# Altium schematic sheet MainBoard_Top.SchDoc
size C
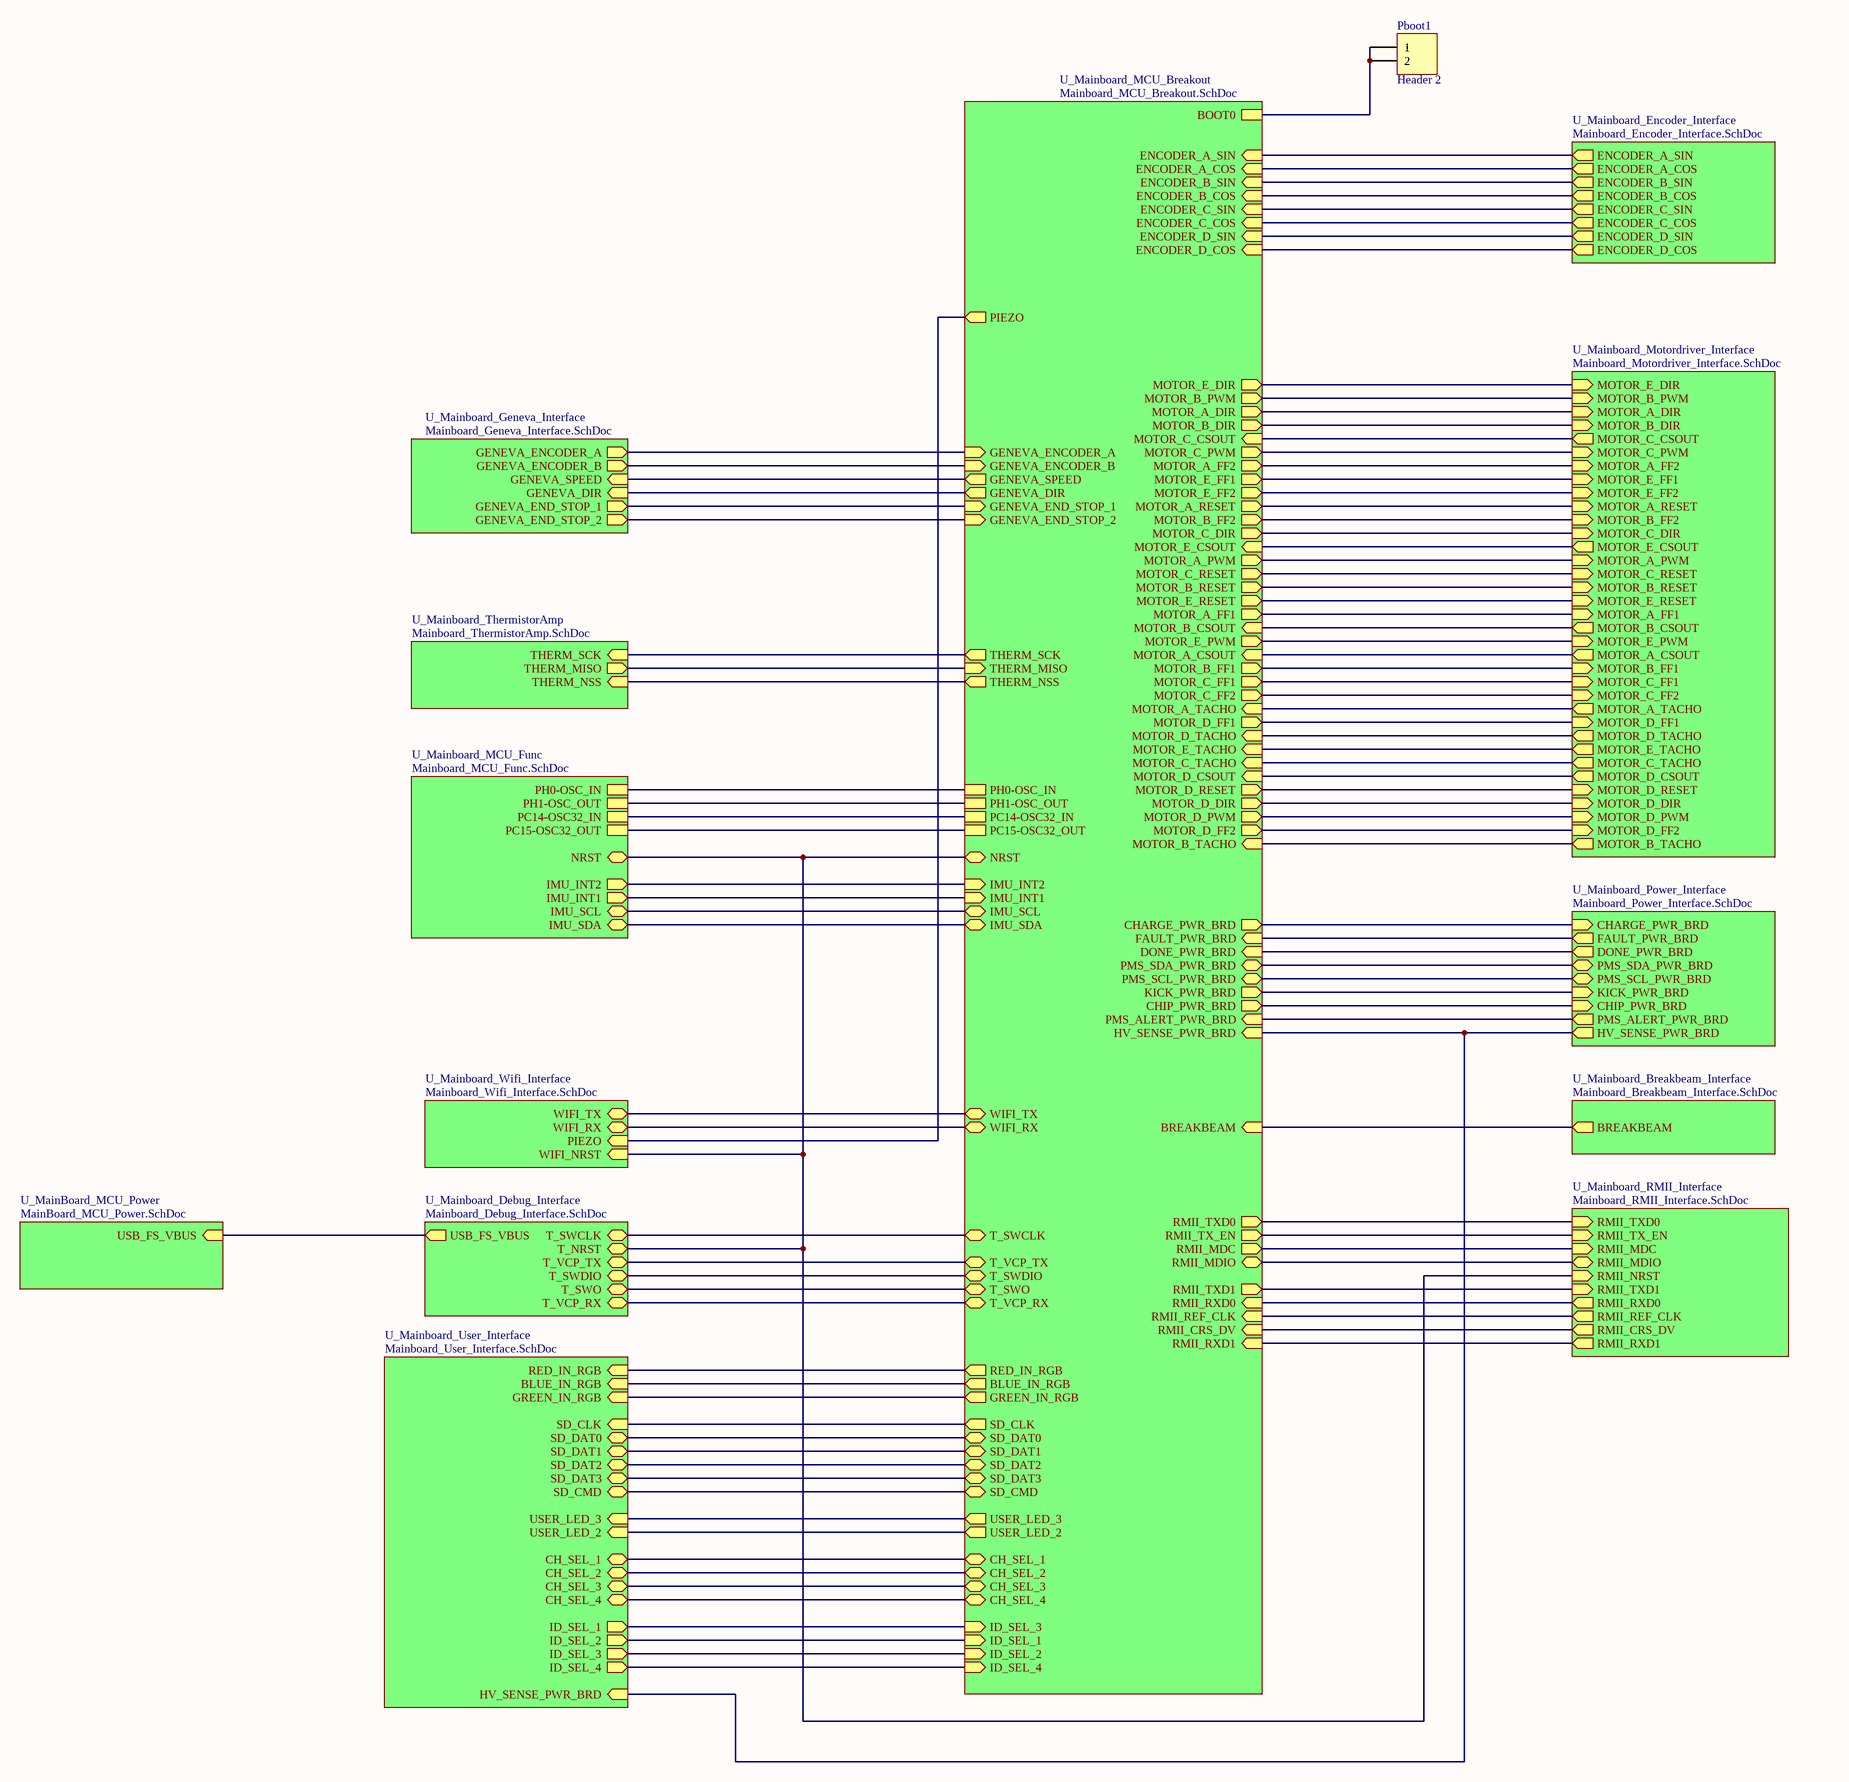
[diagram p0: MainBoard_Top.SchDoc]

## Parts
Pboot1  Header 2  [HDR1X2]

## Sub-sheets
U_Mainboard_Breakbeam_Interface = Mainboard_Breakbeam_Interface.SchDoc: BREAKBEAM (out)
U_Mainboard_Debug_Interface = Mainboard_Debug_Interface.SchDoc: USB_FS_VBUS (out), T_SWCLK (bidir), T_NRST (bidir), T_VCP_TX (bidir), T_SWDIO (bidir), T_SWO (bidir), T_VCP_RX (bidir)
U_Mainboard_Encoder_Interface = Mainboard_Encoder_Interface.SchDoc: ENCODER_A_SIN (out), ENCODER_B_COS (out), ENCODER_C_COS (out), ENCODER_A_COS (out), ENCODER_D_SIN (out), ENCODER_D_COS (out), ENCODER_B_SIN (out), ENCODER_C_SIN (out)
U_Mainboard_Geneva_Interface = Mainboard_Geneva_Interface.SchDoc: GENEVA_SPEED (in), GENEVA_ENCODER_A (out), GENEVA_ENCODER_B (out), GENEVA_DIR (in), GENEVA_END_STOP_1 (out), GENEVA_END_STOP_2 (out)
U_Mainboard_MCU_Breakout = Mainboard_MCU_Breakout.SchDoc: BOOT0, T_SWCLK (bidir), T_VCP_TX (bidir), T_SWDIO (bidir), T_SWO (bidir), T_VCP_RX (bidir), RED_IN_RGB (out), BLUE_IN_RGB (out), GREEN_IN_RGB (out), SD_CLK (out), SD_DAT0 (bidir), SD_DAT1 (bidir), SD_DAT2 (bidir), SD_DAT3 (bidir), SD_CMD (bidir), CH_SEL_1 (bidir), CH_SEL_2 (bidir), CH_SEL_3 (bidir), CH_SEL_4 (bidir), ENCODER_A_SIN (in), ENCODER_A_COS (in), ENCODER_B_SIN (in), ENCODER_B_COS (in), ENCODER_C_SIN (in), ENCODER_C_COS (in), ENCODER_D_SIN (in), ENCODER_D_COS (in), USER_LED_3 (out), USER_LED_2 (out), PC15-OSC32_OUT, PC14-OSC32_IN, PH1-OSC_OUT, NRST (bidir), PH0-OSC_IN, IMU_INT2 (in), IMU_INT1 (in), BREAKBEAM (in), RMII_TXD0 (out), RMII_TX_EN (out), RMII_MDC (out), RMII_MDIO (bidir), RMII_TXD1 (out), RMII_RXD0 (in), RMII_REF_CLK (in), RMII_CRS_DV (in), RMII_RXD1 (in), HV_SENSE_PWR_BRD (in), PMS_ALERT_PWR_BRD (in), CHIP_PWR_BRD (out), KICK_PWR_BRD (out), PMS_SCL_PWR_BRD (bidir), PMS_SDA_PWR_BRD (bidir), DONE_PWR_BRD (in), FAULT_PWR_BRD (in), CHARGE_PWR_BRD (out), IMU_SDA (bidir), IMU_SCL (bidir), THERM_NSS (out), THERM_MISO (in), THERM_SCK (out), WIFI_RX (bidir), WIFI_TX (bidir), ID_SEL_3 (in), ID_SEL_1 (in), ID_SEL_2 (in), ID_SEL_4 (in), MOTOR_E_DIR (out), MOTOR_B_PWM (out), MOTOR_A_DIR (out), MOTOR_B_DIR (out), MOTOR_C_CSOUT (in), MOTOR_C_PWM (out), MOTOR_A_FF2 (out), MOTOR_E_FF1 (out), MOTOR_E_FF2 (out), MOTOR_A_RESET (out), MOTOR_B_FF2 (out), MOTOR_C_DIR (out), MOTOR_E_CSOUT (in), MOTOR_A_PWM (out), MOTOR_C_RESET (out), MOTOR_B_RESET (out), MOTOR_E_RESET (out), MOTOR_A_FF1 (out), MOTOR_B_CSOUT (in), MOTOR_E_PWM (out), MOTOR_A_CSOUT (in), MOTOR_B_FF1 (out), MOTOR_C_FF1 (out), MOTOR_C_FF2 (out), MOTOR_A_TACHO (in), MOTOR_D_FF1 (out), MOTOR_D_TACHO (in), MOTOR_E_TACHO (in), MOTOR_C_TACHO (in), MOTOR_D_CSOUT (in), MOTOR_D_RESET (out), MOTOR_D_DIR (out), MOTOR_D_PWM (out), MOTOR_D_FF2 (out), MOTOR_B_TACHO (in), GENEVA_ENCODER_B (in), GENEVA_ENCODER_A (in), GENEVA_SPEED (out), PIEZO (out), GENEVA_DIR (out), GENEVA_END_STOP_2 (in), GENEVA_END_STOP_1 (in)
U_Mainboard_MCU_Func = Mainboard_MCU_Func.SchDoc: NRST (bidir), IMU_SCL (bidir), IMU_SDA (bidir), IMU_INT1 (out), IMU_INT2 (out), PH0-OSC_IN, PH1-OSC_OUT, PC14-OSC32_IN, PC15-OSC32_OUT
U_MainBoard_MCU_Power = MainBoard_MCU_Power.SchDoc: USB_FS_VBUS (in)
U_Mainboard_Motordriver_Interface = Mainboard_Motordriver_Interface.SchDoc: MOTOR_E_DIR (in), MOTOR_B_PWM (in), MOTOR_A_DIR (in), MOTOR_B_DIR (in), MOTOR_C_CSOUT (out), MOTOR_C_PWM (in), MOTOR_A_FF2 (in), MOTOR_E_FF1 (in), MOTOR_E_FF2 (in), MOTOR_A_RESET (in), MOTOR_B_FF2 (in), MOTOR_C_DIR (in), MOTOR_E_CSOUT (out), MOTOR_A_PWM (in), MOTOR_C_RESET (in), MOTOR_B_RESET (in), MOTOR_E_RESET (in), MOTOR_A_FF1 (in), MOTOR_B_CSOUT (out), MOTOR_E_PWM (in), MOTOR_A_CSOUT (out), MOTOR_B_FF1 (in), MOTOR_C_FF1 (in), MOTOR_C_FF2 (in), MOTOR_A_TACHO (out), MOTOR_D_FF1 (in), MOTOR_D_TACHO (out), MOTOR_E_TACHO (out), MOTOR_C_TACHO (out), MOTOR_D_CSOUT (out), MOTOR_D_RESET (in), MOTOR_D_DIR (in), MOTOR_D_PWM (in), MOTOR_D_FF2 (in), MOTOR_B_TACHO (out)
U_Mainboard_Power_Interface = Mainboard_Power_Interface.SchDoc: CHARGE_PWR_BRD (in), FAULT_PWR_BRD (out), DONE_PWR_BRD (out), PMS_SDA_PWR_BRD (bidir), PMS_SCL_PWR_BRD (bidir), KICK_PWR_BRD (in), CHIP_PWR_BRD (in), PMS_ALERT_PWR_BRD (out), HV_SENSE_PWR_BRD (out)
U_Mainboard_RMII_Interface = Mainboard_RMII_Interface.SchDoc: RMII_TXD0 (in), RMII_TX_EN (in), RMII_RXD0 (out), RMII_REF_CLK (out), RMII_CRS_DV (out), RMII_MDC (in), RMII_MDIO (bidir), RMII_NRST (in), RMII_TXD1 (in), RMII_RXD1 (out)
U_Mainboard_ThermistorAmp = Mainboard_ThermistorAmp.SchDoc: THERM_NSS (in), THERM_MISO (out), THERM_SCK (in)
U_Mainboard_User_Interface = Mainboard_User_Interface.SchDoc: RED_IN_RGB (in), BLUE_IN_RGB (in), GREEN_IN_RGB (in), SD_CLK (in), SD_DAT0 (bidir), SD_DAT1 (bidir), SD_DAT2 (bidir), SD_DAT3 (bidir), SD_CMD (bidir), USER_LED_3 (in), USER_LED_2 (in), CH_SEL_1 (bidir), CH_SEL_2 (bidir), CH_SEL_3 (bidir), CH_SEL_4 (bidir), ID_SEL_1 (out), ID_SEL_2 (out), ID_SEL_3 (out), ID_SEL_4 (out), HV_SENSE_PWR_BRD (in)
U_Mainboard_Wifi_Interface = Mainboard_Wifi_Interface.SchDoc: WIFI_NRST (in), WIFI_TX (bidir), WIFI_RX (bidir), PIEZO (in)

## Nets
NetPboot1_1: Pboot1.1 Pboot1.2 ; sheet U_Mainboard_MCU_Breakout/BOOT0
(unnamed): sheet U_Mainboard_Encoder_Interface/ENCODER_A_SIN, sheet U_Mainboard_MCU_Breakout/ENCODER_A_SIN
(unnamed): sheet U_Mainboard_Encoder_Interface/ENCODER_B_COS, sheet U_Mainboard_MCU_Breakout/ENCODER_B_COS
(unnamed): sheet U_Mainboard_Encoder_Interface/ENCODER_C_COS, sheet U_Mainboard_MCU_Breakout/ENCODER_C_COS
(unnamed): sheet U_Mainboard_Encoder_Interface/ENCODER_A_COS, sheet U_Mainboard_MCU_Breakout/ENCODER_A_COS
(unnamed): sheet U_Mainboard_Encoder_Interface/ENCODER_D_SIN, sheet U_Mainboard_MCU_Breakout/ENCODER_D_SIN
(unnamed): sheet U_Mainboard_Encoder_Interface/ENCODER_D_COS, sheet U_Mainboard_MCU_Breakout/ENCODER_D_COS
(unnamed): sheet U_Mainboard_Encoder_Interface/ENCODER_B_SIN, sheet U_Mainboard_MCU_Breakout/ENCODER_B_SIN
(unnamed): sheet U_Mainboard_Encoder_Interface/ENCODER_C_SIN, sheet U_Mainboard_MCU_Breakout/ENCODER_C_SIN
(unnamed): sheet U_Mainboard_Motordriver_Interface/MOTOR_E_DIR, sheet U_Mainboard_MCU_Breakout/MOTOR_E_DIR
(unnamed): sheet U_Mainboard_Motordriver_Interface/MOTOR_B_PWM, sheet U_Mainboard_MCU_Breakout/MOTOR_B_PWM
(unnamed): sheet U_Mainboard_Motordriver_Interface/MOTOR_A_DIR, sheet U_Mainboard_MCU_Breakout/MOTOR_A_DIR
(unnamed): sheet U_Mainboard_Motordriver_Interface/MOTOR_B_DIR, sheet U_Mainboard_MCU_Breakout/MOTOR_B_DIR
(unnamed): sheet U_Mainboard_Motordriver_Interface/MOTOR_C_CSOUT, sheet U_Mainboard_MCU_Breakout/MOTOR_C_CSOUT
(unnamed): sheet U_Mainboard_Motordriver_Interface/MOTOR_C_PWM, sheet U_Mainboard_MCU_Breakout/MOTOR_C_PWM
(unnamed): sheet U_Mainboard_Motordriver_Interface/MOTOR_A_FF2, sheet U_Mainboard_MCU_Breakout/MOTOR_A_FF2
(unnamed): sheet U_Mainboard_Motordriver_Interface/MOTOR_E_FF1, sheet U_Mainboard_MCU_Breakout/MOTOR_E_FF1
(unnamed): sheet U_Mainboard_Motordriver_Interface/MOTOR_E_FF2, sheet U_Mainboard_MCU_Breakout/MOTOR_E_FF2
(unnamed): sheet U_Mainboard_Motordriver_Interface/MOTOR_A_RESET, sheet U_Mainboard_MCU_Breakout/MOTOR_A_RESET
(unnamed): sheet U_Mainboard_Motordriver_Interface/MOTOR_B_FF2, sheet U_Mainboard_MCU_Breakout/MOTOR_B_FF2
(unnamed): sheet U_Mainboard_Motordriver_Interface/MOTOR_C_DIR, sheet U_Mainboard_MCU_Breakout/MOTOR_C_DIR
(unnamed): sheet U_Mainboard_Motordriver_Interface/MOTOR_E_CSOUT, sheet U_Mainboard_MCU_Breakout/MOTOR_E_CSOUT
(unnamed): sheet U_Mainboard_Motordriver_Interface/MOTOR_A_PWM, sheet U_Mainboard_MCU_Breakout/MOTOR_A_PWM
(unnamed): sheet U_Mainboard_Motordriver_Interface/MOTOR_C_RESET, sheet U_Mainboard_MCU_Breakout/MOTOR_C_RESET
(unnamed): sheet U_Mainboard_Motordriver_Interface/MOTOR_B_RESET, sheet U_Mainboard_MCU_Breakout/MOTOR_B_RESET
(unnamed): sheet U_Mainboard_Motordriver_Interface/MOTOR_E_RESET, sheet U_Mainboard_MCU_Breakout/MOTOR_E_RESET
(unnamed): sheet U_Mainboard_Motordriver_Interface/MOTOR_A_FF1, sheet U_Mainboard_MCU_Breakout/MOTOR_A_FF1
(unnamed): sheet U_Mainboard_Motordriver_Interface/MOTOR_B_CSOUT, sheet U_Mainboard_MCU_Breakout/MOTOR_B_CSOUT
(unnamed): sheet U_Mainboard_Motordriver_Interface/MOTOR_E_PWM, sheet U_Mainboard_MCU_Breakout/MOTOR_E_PWM
(unnamed): sheet U_Mainboard_Motordriver_Interface/MOTOR_A_CSOUT, sheet U_Mainboard_MCU_Breakout/MOTOR_A_CSOUT
(unnamed): sheet U_Mainboard_Motordriver_Interface/MOTOR_B_FF1, sheet U_Mainboard_MCU_Breakout/MOTOR_B_FF1
(unnamed): sheet U_Mainboard_Motordriver_Interface/MOTOR_C_FF1, sheet U_Mainboard_MCU_Breakout/MOTOR_C_FF1
(unnamed): sheet U_Mainboard_Motordriver_Interface/MOTOR_C_FF2, sheet U_Mainboard_MCU_Breakout/MOTOR_C_FF2
(unnamed): sheet U_Mainboard_Motordriver_Interface/MOTOR_A_TACHO, sheet U_Mainboard_MCU_Breakout/MOTOR_A_TACHO
(unnamed): sheet U_Mainboard_Motordriver_Interface/MOTOR_D_FF1, sheet U_Mainboard_MCU_Breakout/MOTOR_D_FF1
(unnamed): sheet U_Mainboard_Motordriver_Interface/MOTOR_D_TACHO, sheet U_Mainboard_MCU_Breakout/MOTOR_D_TACHO
(unnamed): sheet U_Mainboard_Motordriver_Interface/MOTOR_E_TACHO, sheet U_Mainboard_MCU_Breakout/MOTOR_E_TACHO
(unnamed): sheet U_Mainboard_Motordriver_Interface/MOTOR_C_TACHO, sheet U_Mainboard_MCU_Breakout/MOTOR_C_TACHO
(unnamed): sheet U_Mainboard_Motordriver_Interface/MOTOR_D_CSOUT, sheet U_Mainboard_MCU_Breakout/MOTOR_D_CSOUT
(unnamed): sheet U_Mainboard_Motordriver_Interface/MOTOR_D_RESET, sheet U_Mainboard_MCU_Breakout/MOTOR_D_RESET
(unnamed): sheet U_Mainboard_Motordriver_Interface/MOTOR_D_DIR, sheet U_Mainboard_MCU_Breakout/MOTOR_D_DIR
(unnamed): sheet U_Mainboard_Motordriver_Interface/MOTOR_D_PWM, sheet U_Mainboard_MCU_Breakout/MOTOR_D_PWM
(unnamed): sheet U_Mainboard_Motordriver_Interface/MOTOR_D_FF2, sheet U_Mainboard_MCU_Breakout/MOTOR_D_FF2
(unnamed): sheet U_Mainboard_Motordriver_Interface/MOTOR_B_TACHO, sheet U_Mainboard_MCU_Breakout/MOTOR_B_TACHO
(unnamed): sheet U_Mainboard_Power_Interface/CHARGE_PWR_BRD, sheet U_Mainboard_MCU_Breakout/CHARGE_PWR_BRD
(unnamed): sheet U_Mainboard_Power_Interface/FAULT_PWR_BRD, sheet U_Mainboard_MCU_Breakout/FAULT_PWR_BRD
(unnamed): sheet U_Mainboard_Power_Interface/DONE_PWR_BRD, sheet U_Mainboard_MCU_Breakout/DONE_PWR_BRD
(unnamed): sheet U_Mainboard_Power_Interface/PMS_SDA_PWR_BRD, sheet U_Mainboard_MCU_Breakout/PMS_SDA_PWR_BRD
(unnamed): sheet U_Mainboard_Power_Interface/PMS_SCL_PWR_BRD, sheet U_Mainboard_MCU_Breakout/PMS_SCL_PWR_BRD
(unnamed): sheet U_Mainboard_Power_Interface/KICK_PWR_BRD, sheet U_Mainboard_MCU_Breakout/KICK_PWR_BRD
(unnamed): sheet U_Mainboard_Power_Interface/CHIP_PWR_BRD, sheet U_Mainboard_MCU_Breakout/CHIP_PWR_BRD
(unnamed): sheet U_Mainboard_Power_Interface/PMS_ALERT_PWR_BRD, sheet U_Mainboard_MCU_Breakout/PMS_ALERT_PWR_BRD
(unnamed): sheet U_Mainboard_Power_Interface/HV_SENSE_PWR_BRD, sheet U_Mainboard_MCU_Breakout/HV_SENSE_PWR_BRD, sheet U_Mainboard_User_Interface/HV_SENSE_PWR_BRD
(unnamed): sheet U_Mainboard_RMII_Interface/RMII_TXD0, sheet U_Mainboard_MCU_Breakout/RMII_TXD0
(unnamed): sheet U_Mainboard_RMII_Interface/RMII_TX_EN, sheet U_Mainboard_MCU_Breakout/RMII_TX_EN
(unnamed): sheet U_Mainboard_RMII_Interface/RMII_RXD0, sheet U_Mainboard_MCU_Breakout/RMII_RXD0
(unnamed): sheet U_Mainboard_RMII_Interface/RMII_REF_CLK, sheet U_Mainboard_MCU_Breakout/RMII_REF_CLK
(unnamed): sheet U_Mainboard_RMII_Interface/RMII_CRS_DV, sheet U_Mainboard_MCU_Breakout/RMII_CRS_DV
(unnamed): sheet U_Mainboard_RMII_Interface/RMII_MDC, sheet U_Mainboard_MCU_Breakout/RMII_MDC
(unnamed): sheet U_Mainboard_RMII_Interface/RMII_MDIO, sheet U_Mainboard_MCU_Breakout/RMII_MDIO
(unnamed): sheet U_Mainboard_RMII_Interface/RMII_NRST, sheet U_Mainboard_Wifi_Interface/WIFI_NRST, sheet U_Mainboard_Debug_Interface/T_NRST, sheet U_Mainboard_MCU_Breakout/NRST, sheet U_Mainboard_MCU_Func/NRST
(unnamed): sheet U_Mainboard_RMII_Interface/RMII_TXD1, sheet U_Mainboard_MCU_Breakout/RMII_TXD1
(unnamed): sheet U_Mainboard_RMII_Interface/RMII_RXD1, sheet U_Mainboard_MCU_Breakout/RMII_RXD1
(unnamed): sheet U_Mainboard_Wifi_Interface/WIFI_TX, sheet U_Mainboard_MCU_Breakout/WIFI_TX
(unnamed): sheet U_Mainboard_Wifi_Interface/WIFI_RX, sheet U_Mainboard_MCU_Breakout/WIFI_RX
(unnamed): sheet U_Mainboard_Wifi_Interface/PIEZO, sheet U_Mainboard_MCU_Breakout/PIEZO
(unnamed): sheet U_Mainboard_Breakbeam_Interface/BREAKBEAM, sheet U_Mainboard_MCU_Breakout/BREAKBEAM
(unnamed): sheet U_MainBoard_MCU_Power/USB_FS_VBUS, sheet U_Mainboard_Debug_Interface/USB_FS_VBUS
(unnamed): sheet U_Mainboard_Debug_Interface/T_SWCLK, sheet U_Mainboard_MCU_Breakout/T_SWCLK
(unnamed): sheet U_Mainboard_Debug_Interface/T_VCP_TX, sheet U_Mainboard_MCU_Breakout/T_VCP_TX
(unnamed): sheet U_Mainboard_Debug_Interface/T_SWDIO, sheet U_Mainboard_MCU_Breakout/T_SWDIO
(unnamed): sheet U_Mainboard_Debug_Interface/T_SWO, sheet U_Mainboard_MCU_Breakout/T_SWO
(unnamed): sheet U_Mainboard_Debug_Interface/T_VCP_RX, sheet U_Mainboard_MCU_Breakout/T_VCP_RX
(unnamed): sheet U_Mainboard_MCU_Breakout/RED_IN_RGB, sheet U_Mainboard_User_Interface/RED_IN_RGB
(unnamed): sheet U_Mainboard_MCU_Breakout/BLUE_IN_RGB, sheet U_Mainboard_User_Interface/BLUE_IN_RGB
(unnamed): sheet U_Mainboard_MCU_Breakout/GREEN_IN_RGB, sheet U_Mainboard_User_Interface/GREEN_IN_RGB
(unnamed): sheet U_Mainboard_MCU_Breakout/SD_CLK, sheet U_Mainboard_User_Interface/SD_CLK
(unnamed): sheet U_Mainboard_MCU_Breakout/SD_DAT0, sheet U_Mainboard_User_Interface/SD_DAT0
(unnamed): sheet U_Mainboard_MCU_Breakout/SD_DAT1, sheet U_Mainboard_User_Interface/SD_DAT1
(unnamed): sheet U_Mainboard_MCU_Breakout/SD_DAT2, sheet U_Mainboard_User_Interface/SD_DAT2
(unnamed): sheet U_Mainboard_MCU_Breakout/SD_DAT3, sheet U_Mainboard_User_Interface/SD_DAT3
(unnamed): sheet U_Mainboard_MCU_Breakout/SD_CMD, sheet U_Mainboard_User_Interface/SD_CMD
(unnamed): sheet U_Mainboard_MCU_Breakout/CH_SEL_1, sheet U_Mainboard_User_Interface/CH_SEL_1
(unnamed): sheet U_Mainboard_MCU_Breakout/CH_SEL_2, sheet U_Mainboard_User_Interface/CH_SEL_2
(unnamed): sheet U_Mainboard_MCU_Breakout/CH_SEL_3, sheet U_Mainboard_User_Interface/CH_SEL_3
(unnamed): sheet U_Mainboard_MCU_Breakout/CH_SEL_4, sheet U_Mainboard_User_Interface/CH_SEL_4
(unnamed): sheet U_Mainboard_MCU_Breakout/USER_LED_3, sheet U_Mainboard_User_Interface/USER_LED_3
(unnamed): sheet U_Mainboard_MCU_Breakout/USER_LED_2, sheet U_Mainboard_User_Interface/USER_LED_2
(unnamed): sheet U_Mainboard_MCU_Breakout/PC15-OSC32_OUT, sheet U_Mainboard_MCU_Func/PC15-OSC32_OUT
(unnamed): sheet U_Mainboard_MCU_Breakout/PC14-OSC32_IN, sheet U_Mainboard_MCU_Func/PC14-OSC32_IN
(unnamed): sheet U_Mainboard_MCU_Breakout/PH1-OSC_OUT, sheet U_Mainboard_MCU_Func/PH1-OSC_OUT
(unnamed): sheet U_Mainboard_MCU_Breakout/PH0-OSC_IN, sheet U_Mainboard_MCU_Func/PH0-OSC_IN
(unnamed): sheet U_Mainboard_MCU_Breakout/IMU_INT2, sheet U_Mainboard_MCU_Func/IMU_INT2
(unnamed): sheet U_Mainboard_MCU_Breakout/IMU_INT1, sheet U_Mainboard_MCU_Func/IMU_INT1
(unnamed): sheet U_Mainboard_MCU_Breakout/IMU_SDA, sheet U_Mainboard_MCU_Func/IMU_SDA
(unnamed): sheet U_Mainboard_MCU_Breakout/IMU_SCL, sheet U_Mainboard_MCU_Func/IMU_SCL
(unnamed): sheet U_Mainboard_MCU_Breakout/THERM_NSS, sheet U_Mainboard_ThermistorAmp/THERM_NSS
(unnamed): sheet U_Mainboard_MCU_Breakout/THERM_MISO, sheet U_Mainboard_ThermistorAmp/THERM_MISO
(unnamed): sheet U_Mainboard_MCU_Breakout/THERM_SCK, sheet U_Mainboard_ThermistorAmp/THERM_SCK
(unnamed): sheet U_Mainboard_MCU_Breakout/ID_SEL_3, sheet U_Mainboard_User_Interface/ID_SEL_1
(unnamed): sheet U_Mainboard_MCU_Breakout/ID_SEL_1, sheet U_Mainboard_User_Interface/ID_SEL_2
(unnamed): sheet U_Mainboard_MCU_Breakout/ID_SEL_2, sheet U_Mainboard_User_Interface/ID_SEL_3
(unnamed): sheet U_Mainboard_MCU_Breakout/ID_SEL_4, sheet U_Mainboard_User_Interface/ID_SEL_4
(unnamed): sheet U_Mainboard_MCU_Breakout/GENEVA_ENCODER_B, sheet U_Mainboard_Geneva_Interface/GENEVA_ENCODER_B
(unnamed): sheet U_Mainboard_MCU_Breakout/GENEVA_ENCODER_A, sheet U_Mainboard_Geneva_Interface/GENEVA_ENCODER_A
(unnamed): sheet U_Mainboard_MCU_Breakout/GENEVA_SPEED, sheet U_Mainboard_Geneva_Interface/GENEVA_SPEED
(unnamed): sheet U_Mainboard_MCU_Breakout/GENEVA_DIR, sheet U_Mainboard_Geneva_Interface/GENEVA_DIR
(unnamed): sheet U_Mainboard_MCU_Breakout/GENEVA_END_STOP_2, sheet U_Mainboard_Geneva_Interface/GENEVA_END_STOP_2
(unnamed): sheet U_Mainboard_MCU_Breakout/GENEVA_END_STOP_1, sheet U_Mainboard_Geneva_Interface/GENEVA_END_STOP_1

## Library data of the parts
Pboot1 = Header 2: Header, 2-Pin; LatestRevisionDate: 17-Jul-2002; LatestRevisionNote: Re-released for DXP Platform.; Publisher: Altium Limited